# EAGLE design smartwatch (EAGLE 6.3)
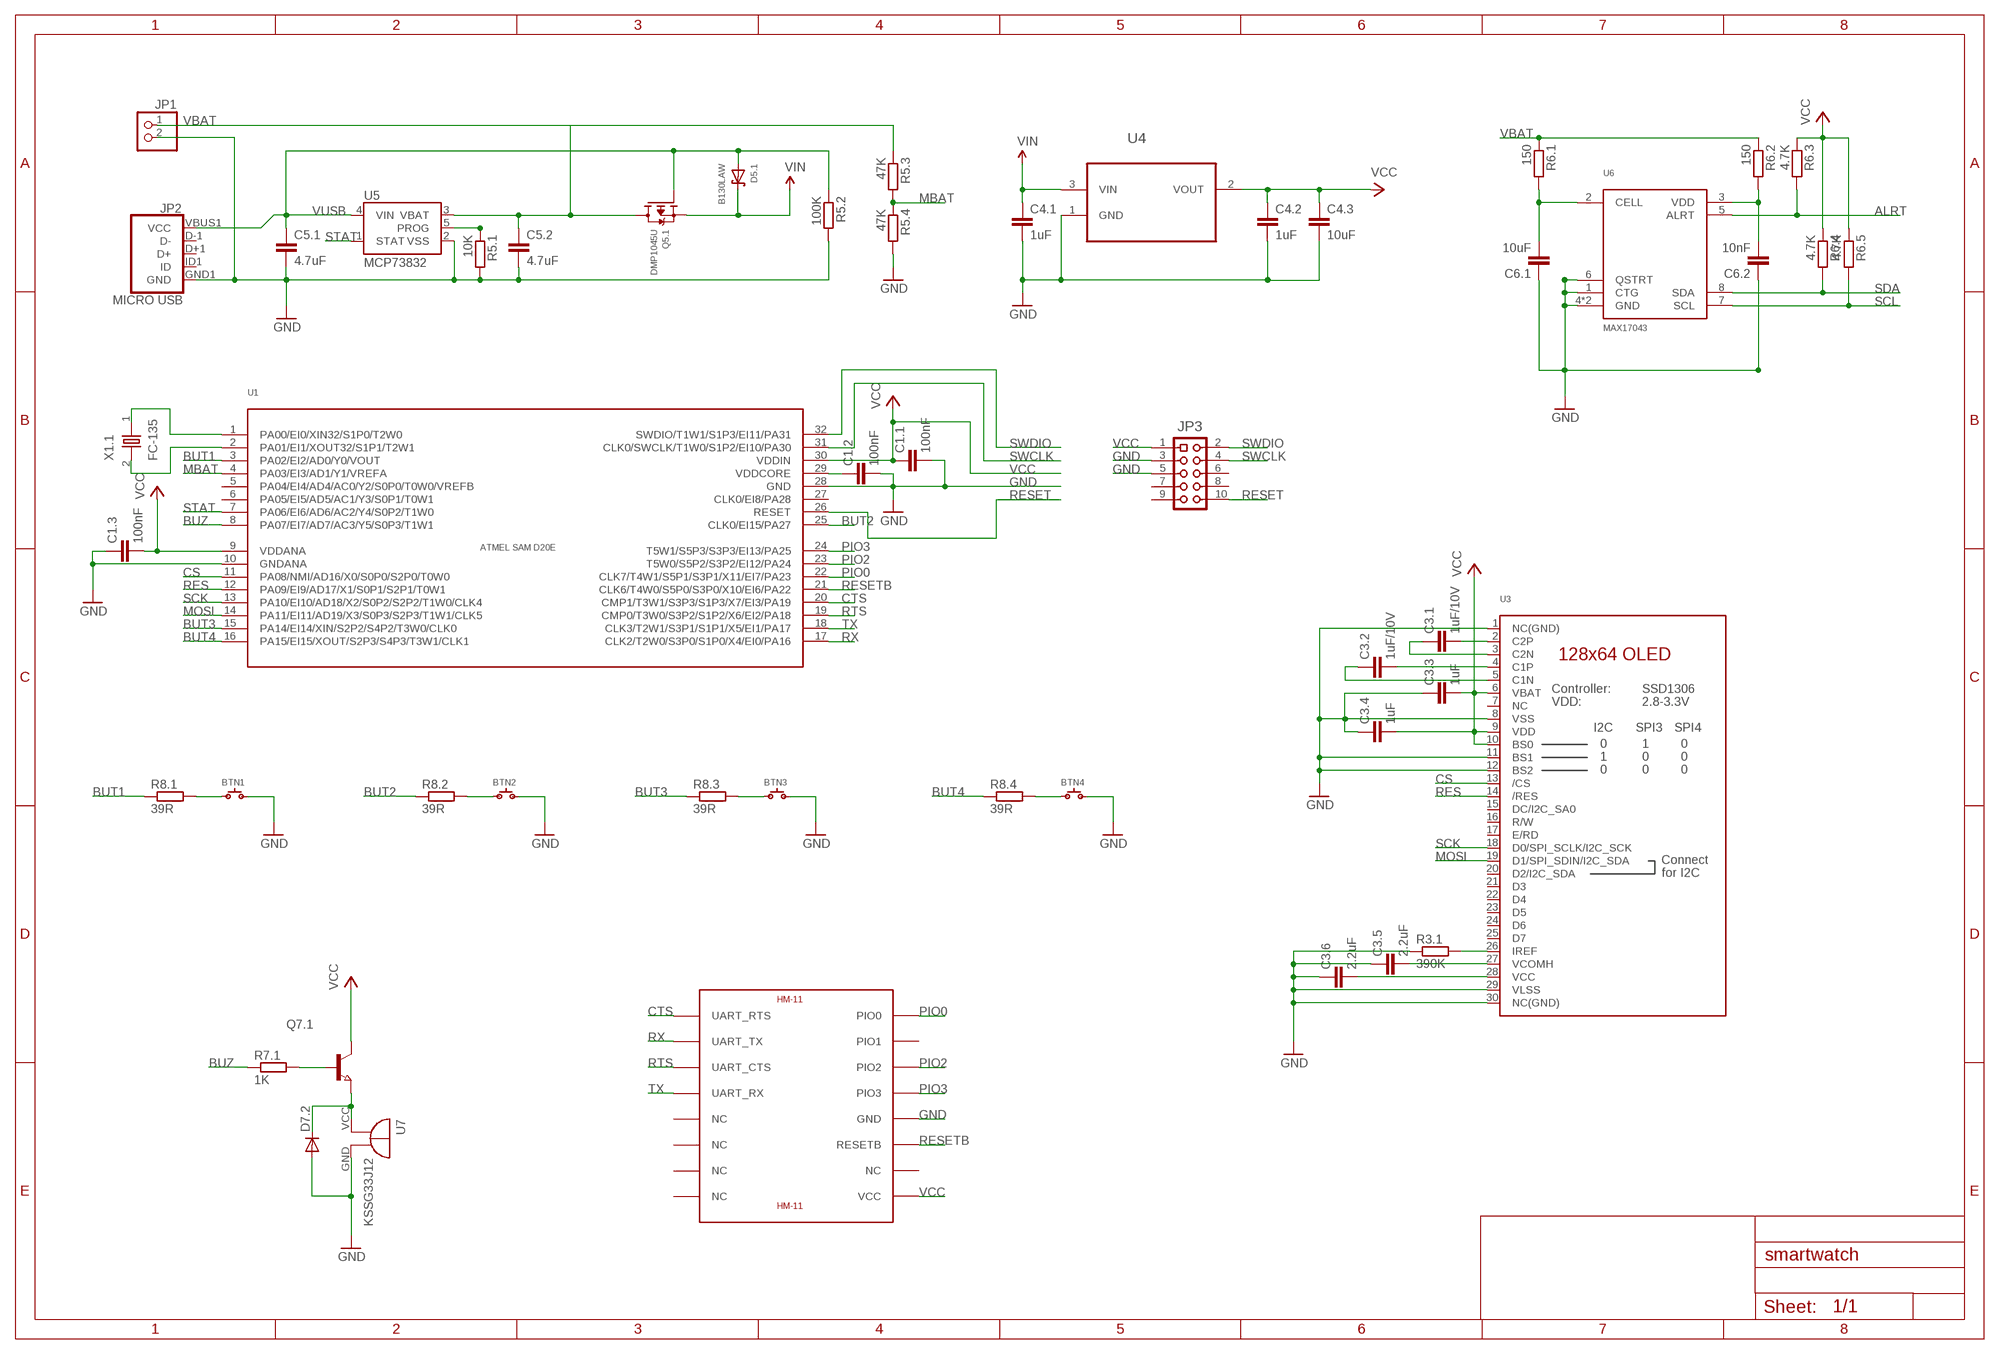
[diagram p0: schematic, sheet 1]

## Parts
BTN1  SPST.B3U-3000P(M)  [B3U-3000P(M)]
BTN2  SPST.B3U-3000P(M)  [B3U-3000P(M)]
BTN3  SPST.B3U-3000P(M)  [B3U-3000P(M)]
BTN4  SPST.B3U-3000P(M)  [B3U-3000P(M)]
C1.1  100nF  C-EUC0805  [C0805]
C1.2  100nF  C-EUC0805  [C0805]
C1.3  100nF  C-EUC0805  [C0805]
C3.1  1uF/10V  C-EUC0805  [C0805]
C3.2  1uF/10V  C-EUC0805  [C0805]
C3.3  1uF  C-EUC0805  [C0805]
C3.4  1uF  C-EUC0805  [C0805]
C3.5  2.2uF  C-EUC0805  [C0805]
C3.6  2.2uF  C-EUC0805  [C0805]
C4.1  1uF  C-EUC0805  [C0805]
C4.2  1uF  C-EUC0805  [C0805]
C4.3  10uF  C-EUC0805  [C0805]
C5.1  4.7uF  C-EUC0805  [C0805]
C5.2  4.7uF  C-EUC0805  [C0805]
C6.1  10uF  C-EUC0805  [C0805]
C6.2  10nF  C-EUC0805  [C0805]
D5.1  B130LAW  DIODE-SCHOTTKYSOD-123  [SOD-123]
D7.2  CGRM4001-G  [SOD-123_MINI-SMA]
JP1  PINHD-1X2  [1X02]
JP2  MICRO USB  USB_MICROB_PLUGCONN-11752  [USB-B-MICRO-SMD_V03]
JP3  PF2X5SMD1.27MM  [PF2X5SMD50MIL]
Q5.1  DMP1045U  MOSFET-P  [SOT23-R]
Q7.1  NPN-TRANSISTOR_SOT23  [SOT23]
R3.1  390K  R-EU_R2012  [R2012]
R5.1  10K  R-EU_R2012  [R2012]
R5.2  100K  R-EU_R2012  [R2012]
R5.3  47K  R-EU_R2012  [R2012]
R5.4  47K  R-EU_R2012  [R2012]
R6.1  150  R-EU_R2012  [R2012]
R6.2  150  R-EU_R2012  [R2012]
R6.3  4.7K  R-EU_R2012  [R2012]
R6.4  4.7K  R-EU_R2012  [R2012]
R6.5  4.7K  R-EU_R2012  [R2012]
R7.1  1K  R-EU_R2012  [R2012]
R8.1  39R  R-EU_R2012  [R2012]
R8.2  39R  R-EU_R2012  [R2012]
R8.3  39R  R-EU_R2012  [R2012]
R8.4  39R  R-EU_R2012  [R2012]
U1  SAMD20E  [TQFP32-08]
U2  HM-11  [HM-11]
U3  DISP_OLED_UG-2864HSWEG010.96"  [UG-2864HSWEG01_0.96IN_WRAPAROUND]
U4  MCP1700T-3302E/TT  [SOT95P237X112-3N]
U5  MCP73832  MCP73831  [SOT23-5]
U6  MAX17043  [8-TDFN-EP]
U7  KSSG33J12  [KSSG33J12]
X1.1  FC-135  FC-135FC-135  [FC-135]

## Nets
ALRT: R6.3.2 U6.5(ALRT)
BUT1: R8.1.1 U1.3(PA02/EI2/AD0/Y0/VOUT)
BUT2: R8.2.1 U1.25(CLK0/EI15/PA27)
BUT3: R8.3.1 U1.15(PA14/EI14/XIN/S2P2/S4P2/T3W0/CLK0)
BUT4: R8.4.1 U1.16(PA15/EI15/XOUT/S2P3/S4P3/T3W1/CLK1)
BUZ: R7.1.1 U1.8(PA07/EI7/AD7/AC3/Y5/S0P3/T1W1)
CS: U1.11(PA08/NMI/AD16/X0/S0P0/S2P0/T0W0) U3.13(/CS)
CTS: U1.20(CMP1/T3W1/S3P3/S1P3/X7/EI3/PA19) U2.UART_RTS
GND: BTN1.2 BTN2.2 BTN3.2 BTN4.2 C1.1.2 C1.2.2 C1.3.1 C3.3.1 C3.4.1 C3.5.1 C3.6.1 C4.1.2 C4.2.2 C4.3.2 C5.1.2 C5.2.2 C6.1.1 C6.2.1 D7.2.A JP1.2 JP2.GND1(GND) JP3.3 JP3.5 R3.1.1 R5.1.2 R5.2.2 R5.4.2 U1.10(GNDANA) U1.28(GND) U2.GND U3.1(NC(GND)) U3.8(VSS) U3.11(BS1) U3.12(BS2) U3.29(VLSS) U3.30(NC(GND)) U4.1(GND) U5.2(VSS) U6.1(CTG) U6.4(GND) U6.6(QSTRT) U6.9(GND) U7.GND(-)
MBAT: R5.3.2 R5.4.1 U1.4(PA03/EI3/AD1/Y1/VREFA)
MOSI: U1.14(PA11/EI11/AD19/X3/S0P3/S2P3/T1W1/CLK5) U3.19(D1/SPI_SDIN/I2C_SDA)
N$1: C3.1.2 U3.2(C2P)
N$2: C3.1.1 U3.3(C2N)
N$3: C3.2.2 U3.4(C1P)
N$4: C3.2.1 U3.5(C1N)
N$5: R3.1.2 U3.26(IREF)
N$7: C3.5.2 U3.27(VCOMH)
N$8: C3.6.2 U3.28(VCC)
N$9: BTN1.1 R8.1.2
N$12: U1.1(PA00/EI0/XIN32/S1P0/T2W0) X1.1.1
N$13: U1.2(PA01/EI1/XOUT32/S1P1/T2W1) X1.1.2
N$14: D7.2.C Q7.1.2(E) U7.VCC(+)
N$15: Q7.1.1(B) R7.1.2
N$16: BTN2.1 R8.2.2
N$17: C6.2.2 R6.2.2 U6.3(VDD)
N$18: BTN3.1 R8.3.2
N$19: BTN4.1 R8.4.2
N$20: C6.1.2 R6.1.2 U6.2(CELL)
PIO0: U1.22(CLK7/T4W1/S5P1/S3P1/X11/EI7/PA23) U2.PIO0
PIO2: U1.23(T5W0/S5P2/S3P2/EI12/PA24) U2.PIO2
PIO3: U1.24(T5W1/S5P3/S3P3/EI13/PA25) U2.PIO3
PROG: R5.1.1 U5.5(PROG)
RES: U1.12(PA09/EI9/AD17/X1/S0P1/S2P1/T0W1) U3.14(/RES)
RESET: JP3.10 U1.26(RESET)
RESETB: U1.21(CLK6/T4W0/S5P0/S3P0/X10/EI6/PA22) U2.RESETB
RTS: U1.19(CMP0/T3W0/S3P2/S1P2/X6/EI2/PA18) U2.UART_CTS
RX: U1.17(CLK2/T2W0/S3P0/S1P0/X4/EI0/PA16) U2.UART_TX
SCK: U1.13(PA10/EI10/AD18/X2/S0P2/S2P2/T1W0/CLK4) U3.18(D0/SPI_SCLK/I2C_SCK)
SCL: R6.5.2 U6.7(SCL)
SDA: R6.4.2 U6.8(SDA)
STAT: U1.7(PA06/EI6/AD6/AC2/Y4/S0P2/T1W0) U5.1(STAT)
SWCLK: JP3.4 U1.31(CLK0/SWCLK/T1W0/S1P2/EI10/PA30)
SWDIO: JP3.2 U1.32(SWDIO/T1W1/S1P3/EI11/PA31)
TX: U1.18(CLK3/T2W1/S3P1/S1P1/X5/EI1/PA17) U2.UART_RX
VBAT: C5.2.1 JP1.1 Q5.1.3(D) R5.3.1 R6.1.1 R6.2.1 U5.3(VBAT)
VCC: C1.1.1 C1.3.2 C3.3.2 C3.4.2 C4.2.1 C4.3.1 JP3.1 Q7.1.3(C) R6.3.1 R6.4.1 R6.5.1 U1.9(VDDANA) U1.30(VDDIN) U2.VCC U3.6(VBAT) U3.9(VDD) U3.10(BS0) U4.2(VOUT)
VDDCORE: C1.2.1 U1.29(VDDCORE)
VIN: C4.1.1 D5.1.C Q5.1.2(S) U4.3(VIN)
VUSB: C5.1.1 D5.1.A JP2.VBUS1(VCC) Q5.1.1(G) R5.2.1 U5.4(VIN)
Unconnected: JP2.D+1(D+) JP2.D-1(D-) JP2.ID1(ID) JP3.6 JP3.7 JP3.8 JP3.9 U1.5(PA04/EI4/AD4/AC0/Y2/S0P0/T0W0/VREFB) U1.6(PA05/EI5/AD5/AC1/Y3/S0P1/T0W1) U1.27(CLK0/EI8/PA28) U2.NC@5(NC) U2.NC@6(NC) U2.NC@7(NC) U2.NC@8(NC) U2.NC@10(NC) U2.PIO1 U3.7(NC) U3.15(DC/I2C_SA0) U3.16(R/W) U3.17(E/RD) U3.20(D2/I2C_SDA) U3.21(D3) U3.22(D4) U3.23(D5) U3.24(D6) U3.25(D7)

## Library data of the parts
BTN1-BTN4 = omron:SPST
C1.1-C1.3 C3.1-C3.6 C4.1-C4.3 C5.1 C5.2 C6.1 C6.2 = rcl:C-EU: CAPACITOR, European symbol
D5.1 = lbrzak:DIODE-SCHOTTKY
D7.2 = diode:CGRM400*-G: Molded plasitc,JEDEC SOD-123/Mini SMA Source: Comchip CGRM4001-G.pdf
JP1 = pinhead:PINHD-1X2: PIN HEADER
JP2 = SparkFun-Connectors:USB_MICROB_PLUG: USB Micro-B Plug Comes in a variety of packages. Check out Hirose's ZX-x0 line: http://www.hirose.co.jp/cataloge_hp/e24200011.pdf; PROD_ID: CONN-11752
JP3 = A_CONN:PF2X5
Q5.1 = lbrmicrobuilder:MOSFET-P: P-Channel Mosfet LEGEND VDS: Voltage Drain-Source ID: Drain Current RDS(ON): Drain-Source On-State Resistance VGS(TH): Gate-Source Threshold Voltage CISS: Drain-Source Input Capacitance SOT-23 Name VDS ID RDS(ON) VGS(TH) CISS Order Number IRLML5103 30V 760mA 600 mOhm -- 75pF @ 25V Digikey: IRLML5103PBFCT-ND IRLML6401 12V 4.3A 50 mOhm 950mV @ 250µA 830pF @ 10V Digikey: IRLML6401PBFTR-ND NTR0202PL 20V 400mA 800 mOhm 2.3V @ 250uA 70pF @ 5V Digikey: NTR0202PLT1GOSTR-ND NTR4101PT1G 20V 1.8A 85 mOhm 1.2V @ 250uA 675pF @ 10V Digikey: NTR4101PT1GOSCT-ND DMP2004K 20V 600mA 900 mOhm 1V @ 250uA 175pF @ 16V Digikey: DMP2004KDICT-ND PMV65XP 20V 3.9A 76 mOhm 950mV @ 1mA 725pF @ 20V Digikey: 568-2358-2-ND TO-252 Name VDS ID RDS(ON) VGS(TH) CISS Order Number AOD417 30V 25A 34 mOhm 3V @ 250µA 920pF @ 15V Digikey: 785-1106-2-ND
Q7.1 = semicon-smd-ipc:NPN-TRANSISTOR_: NPN TRANSISTOR
R3.1 R5.1-R5.4 R6.1-R6.5 R7.1 R8.1-R8.4 = resistor:R-EU_: RESISTOR, European symbol
U1 = samd20:SAMD20E
U2 = hm-11:HM-11: JNHuaMao HM-11 Bluetooth 4.0 Transceiver based on TI CC2540/CC2541
U3 = microbuilder:DISP_OLED_UG-2864HSWEG01: UG-2864HSWEG01 OLED display Both 1.3" and 0.96" models share the same FPC tab footprint, only the screen dimensions vary.
U4 = mcp1700T-330:MCP1700T-3302E/TT: Low Quiescent Current LDO; MPN: MCP1700T-3302E/TT; OC_FARNELL: 1296592; OC_NEWARK: 88H9817; PACKAGE: SOT23-3; SUPPLIER: Microchip
U5 = SparkFun:MCP73831: Microchip's MCP73831 Miniature single cell, fully integrated Li-Ion, Li-polymer charge management controller http://ww1.microchip.com/downloads/en/DeviceDoc/21984a.pdf
U6 = max17043:MAX17043
U7 = kssg33j12:KSSG33J12
X1.1 = m-pad-2.1:FC-135: Epson's FC-135 FC-145 Thin SMD High-Frequency Crystal unit High density mounting type SMD of 0.8mm Typ. thickness Excellent environmental capability Small packaging area and light weight Most suitable for small communication devices. Please send any comments to: messi@users.sourceforge.net

## Board
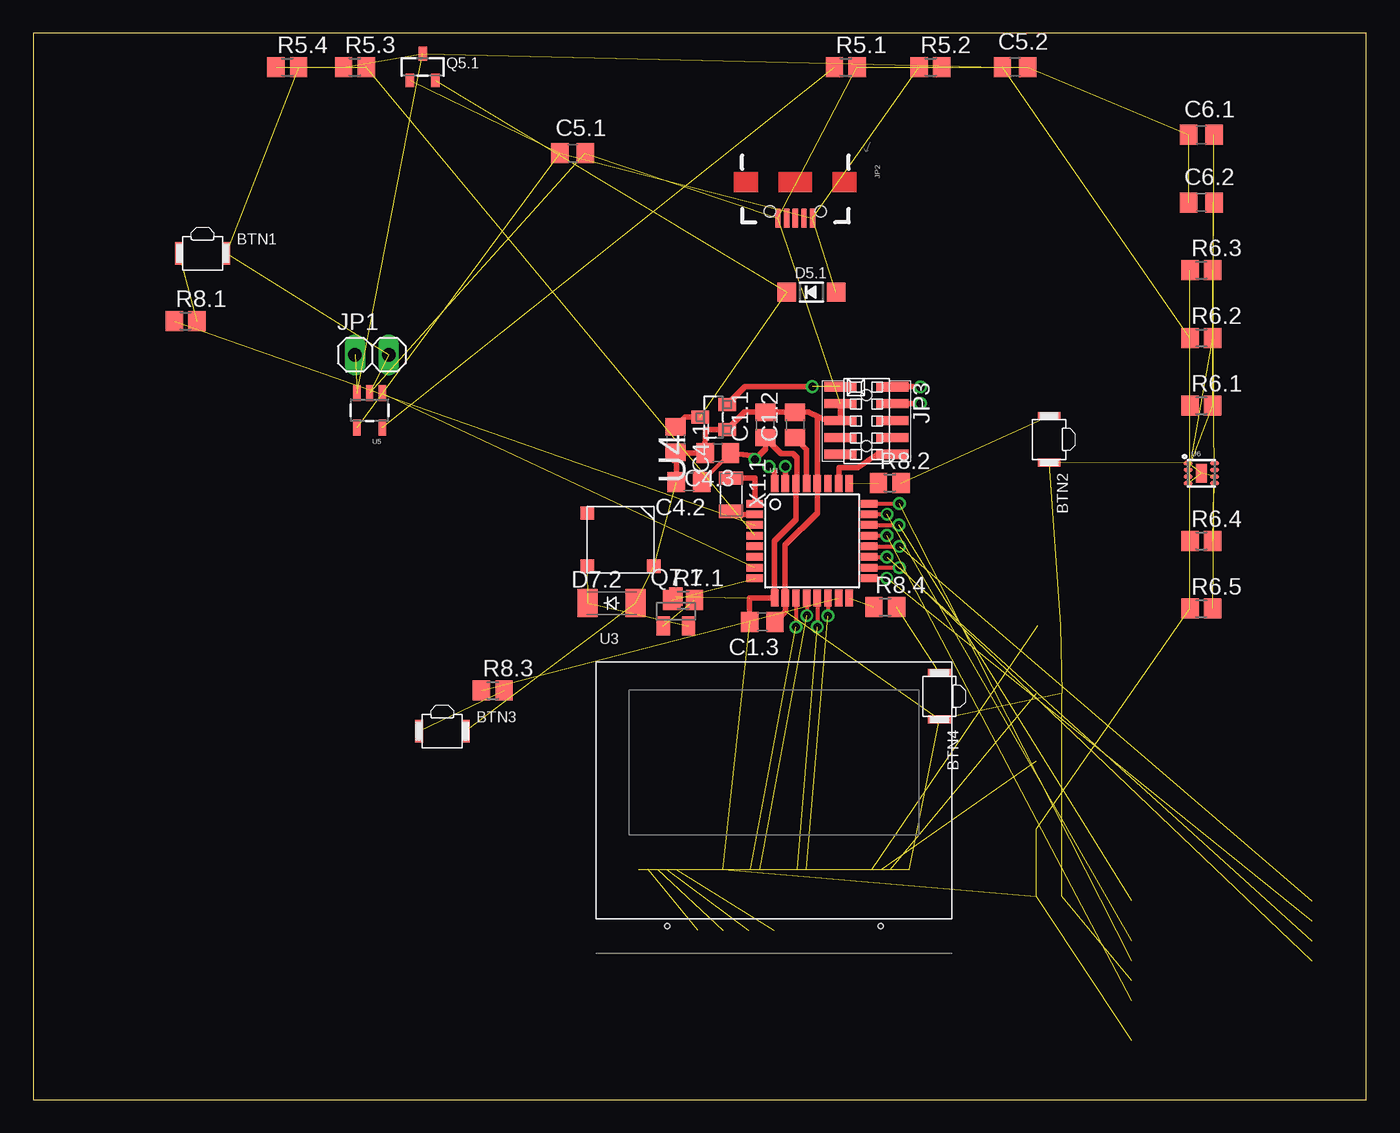
[diagram p1: board, top side]
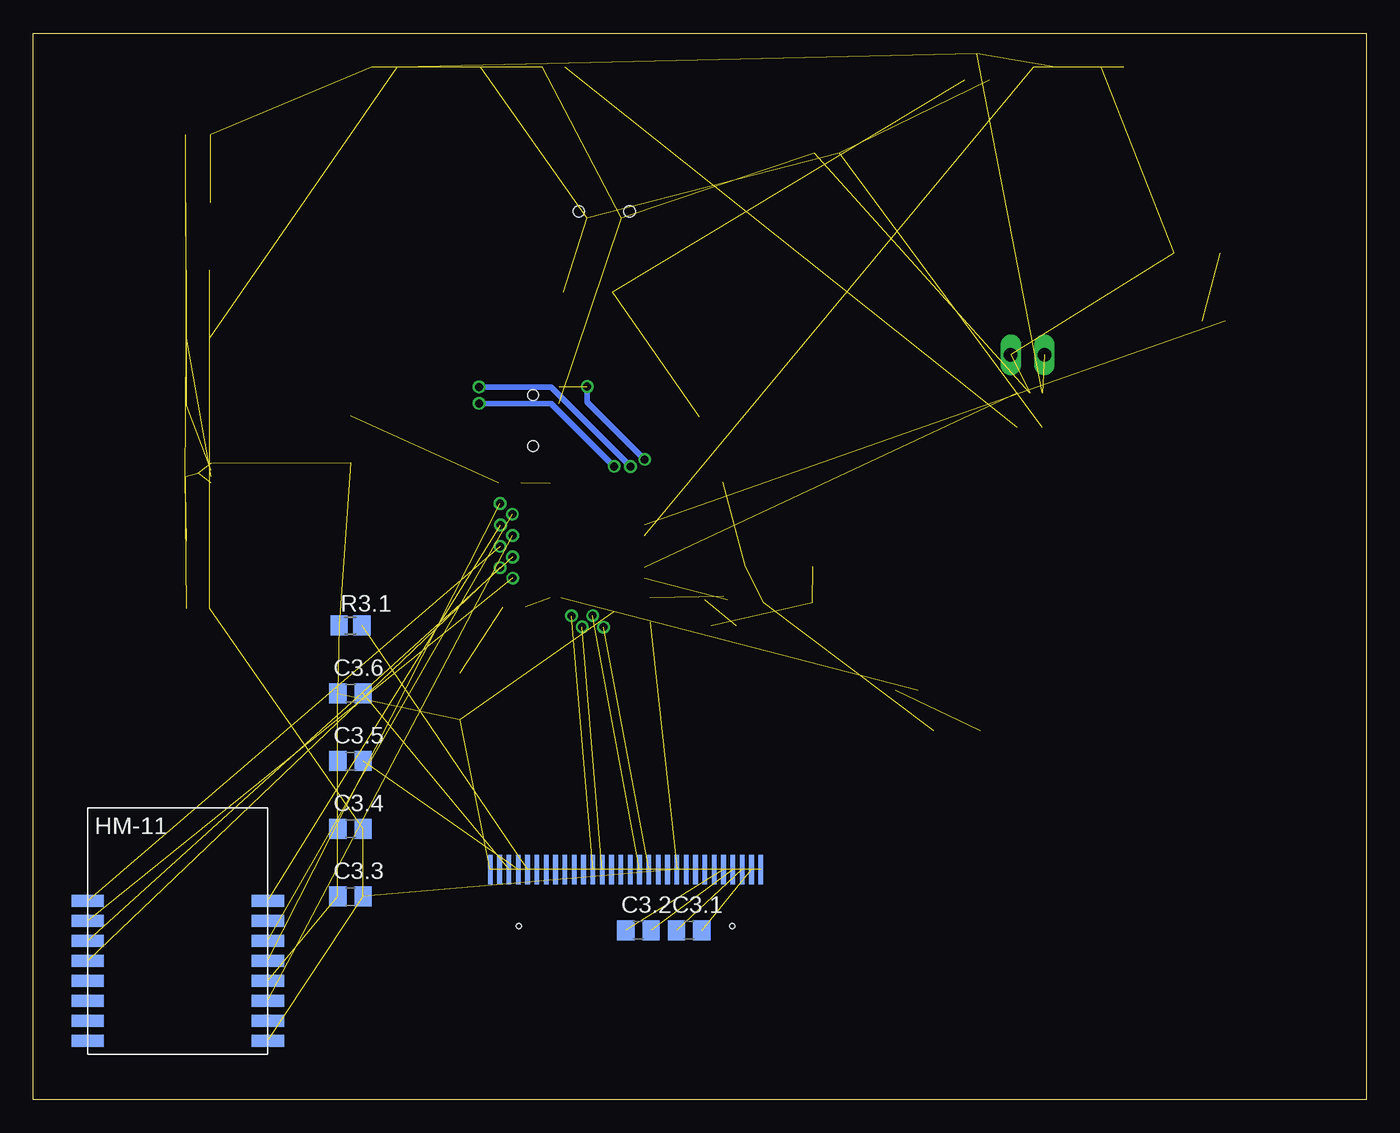
[diagram p2: board, bottom side, seen from below]

Size 100 x 80 mm. Coordinates in mm from the lower left corner, seen from the top.
Outline: 0,0 100,0 100,80 0,80 0,0
Copper layers (1*16): Top 0.0356mm / dielectric 1.5011mm / Bottom 0.0356mm
Design rules "LaenPCBOrder": minimum track width 6mil, minimum drill 13mil, track to track 6mil, track to pad 6mil, pad to pad 6mil, via to via 6mil, smd to smd 6mil, copper to edge 15mil, drill to drill 6mil, minimum pad ring 7mil, minimum via ring 7mil, stop-mask expansion 3mil, vias tented up to drill 0mil, thermal gap 10mil

### Footprints (pad centres in the part's own frame; a part is rotated, then mirrored left to right if it is on the bottom)
B3U-3000P(M) = smd 0.6 x 1.7: 1 -1.75,0; 2 1.75,0
C0805 = smd 1.3 x 1.5: 1 -0.95,0; 2 0.95,0
SOD-123 = smd 1.4 x 1.4: A 1.85,0; C -1.85,0
SOD-123_MINI-SMA = smd 1.5 x 2.1: A 1.8,0; C -1.8,0
1X02 = drill 1.016 long: 1 -1.27,0; 2 1.27,0
USB-B-MICRO-SMD_V03 = smd 1.4 x 0.4: D+1 2.7,0; D-1 2.7,0.65; GND1 2.7,-1.3; ID1 2.7,-0.65; VBUS1 2.7,1.3 | hole 0.85: 2.2,1.9; 2.2,-1.9
PF2X5SMD50MIL = smd 0.7 x 2.4: 1 -2.54,-1.95; 2 -2.54,1.95; 3 -1.27,-1.95; 4 -1.27,1.95; 5 0,-1.95; 6 0,1.95; 7 1.27,-1.95; 8 1.27,1.95; 9 2.54,-1.95; 10 2.54,1.95 | hole 0.8: -1.905,0; 1.905,0
SOT23-R = smd 0.635 x 1.016: 1 -0.95,-1; 2 0.95,-1; 3 0,1
SOT23 = smd 1 x 1.4: 1 -0.95,-1.1; 2 0.95,-1.1; 3 0,1.1
R2012 = smd 1.3 x 1.5: 1 -0.85,0; 2 0.85,0
TQFP32-08 = smd 1.27 x 0.559: 1 -4.293,2.8; 2 -4.293,2; 3 -4.293,1.2; 4 -4.293,0.4; 5 -4.293,-0.4; 6 -4.293,-1.2; 7 -4.293,-2; 8 -4.293,-2.8; 17 4.293,-2.8; 18 4.293,-2; 19 4.293,-1.2; 20 4.293,-0.4; 21 4.293,0.4; 22 4.293,1.2; 23 4.293,2; 24 4.293,2.8 | smd 0.559 x 1.27: 9 -2.8,-4.293; 10 -2,-4.293; 11 -1.2,-4.293; 12 -0.4,-4.293; 13 0.4,-4.293; 14 1.2,-4.293; 15 2,-4.293; 16 2.8,-4.293; 25 2.8,4.293; 26 2,4.293; 27 1.2,4.293; 28 0.4,4.293; 29 -0.4,4.293; 30 -1.2,4.293; 31 -2,4.293; 32 -2.8,4.293
HM-11 = smd 2.4 x 0.9: GND 6.5,0; NC@5 -7,0; NC@6 -7,-1.5; NC@7 -7,-3; NC@8 -7,-4.5; NC@10 6.5,-3; PIO0 6.5,6; PIO1 6.5,4.5; PIO2 6.5,3; PIO3 6.5,1.5; RESETB 6.5,-1.5; UART_CTS -7,3; UART_RTS -7,6; UART_RX -7,1.5; UART_TX -7,4.5; VCC 6.5,-4.5
UG-2864HSWEG01_0.96IN_WRAPAROUND = smd 0.35 x 2.2 bottom: 1 -10.15,-1.2; 2 -9.45,-1.2; 3 -8.75,-1.2; 4 -8.05,-1.2; 5 -7.35,-1.2; 6 -6.65,-1.2; 7 -5.95,-1.2; 8 -5.25,-1.2; 9 -4.55,-1.2; 10 -3.85,-1.2; 11 -3.15,-1.2; 12 -2.45,-1.2; 13 -1.75,-1.2; 14 -1.05,-1.2; 15 -0.35,-1.2; 16 0.35,-1.2; 17 1.05,-1.2; 18 1.75,-1.2; 19 2.45,-1.2; 20 3.15,-1.2; 21 3.85,-1.2; 22 4.55,-1.2; 23 5.25,-1.2; 24 5.95,-1.2; 25 6.65,-1.2; 26 7.35,-1.2; 27 8.05,-1.2; 28 8.75,-1.2; 29 9.45,-1.2; 30 10.15,-1.2 | hole 0.4: -8,-5.45; 8,-5.45
SOT95P237X112-3N = smd 0.991 x 1.321: 1 -0.94,-1.016; 2 0.94,-1.016; 3 0,1.016
SOT23-5 = smd 0.55 x 1.2: 1 -0.95,-1.3; 2 0,-1.3; 3 0.95,-1.3; 4 0.95,1.3; 5 -0.95,1.3
8-TDFN-EP = smd 0.7 x 0.3: 1 -0.99,0.75; 2 -0.99,0.25; 3 -0.99,-0.25; 4 -0.99,-0.75; 5 0.99,-0.75; 6 0.99,-0.25; 7 0.99,0.25; 8 0.99,0.75 | smd 0.8 x 1.38: 9 0,0
KSSG33J12 = smd 1 x 1: GND 2,-2.5; NC -3,1.5; VCC -3,-2.5
FC-135 = smd 1 x 1.8: 1 -1.25,0; 2 1.25,0

### Placement (x,y rotation side)
BTN1  12.7,63.5 0 top
BTN2  76.2,49.53 270 top
BTN3  30.68,27.64 0 top
BTN4  67.99,30.25 270 top
C1.1  54.92,50.62 90 top
C1.2  57.15,50.62 90 top
C1.3  54.7,35.84 180 top
C3.1  50.8,12.7 0 bottom
C3.2  54.61,12.7 0 bottom
C3.3  76.2,15.24 0 bottom
C3.4  76.2,20.32 0 bottom
C3.5  76.2,25.4 0 bottom
C3.6  76.2,30.48 0 bottom
C4.1  48.19,49.52 270 top
C4.2  49.19,46.34 180 top
C4.3  51.36,48.51 180 top
C5.1  40.46,70.99 0 top
C5.2  73.66,77.47 0 top
C6.1  87.63,72.39 0 top
C6.2  87.63,67.31 0 top
D5.1  58.38,60.58 0 top
D7.2  43.4,37.24 0 top
JP1  25.4,55.88 0 top
JP2  57.17,68.83 270 top
JP3  62.51,50.94 270 top
Q5.1  29.21,77.47 0 top
Q7.1  48.2,36.63 0 top
R3.1  76.2,35.56 0 bottom
R5.1  60.96,77.47 0 top
R5.2  67.31,77.47 0 top
R5.3  24.13,77.47 0 top
R5.4  19.05,77.47 0 top
R6.1  87.63,52.07 0 top
R6.2  87.63,57.15 0 top
R6.3  87.63,62.23 0 top
R6.4  87.63,41.91 0 top
R6.5  87.63,36.83 0 top
R7.1  48.75,37.47 0 top
R8.1  11.43,58.42 0 top
R8.2  64.26,46.26 0 top
R8.3  34.47,30.69 0 top
R8.4  63.91,36.95 0 top
U1  58.42,41.91 0 top
U2  88.9,8.89 0 bottom
U3  55.57,18.46 0 top
U4  51.05,51.2 90 top
U5  25.23,51.72 180 top
U6  87.63,46.99 0 top
U7  44.55,42.5 0 top
X1.1  52.36,45.38 270 top

### Tracks (layer width: path | path; a pad name or v marks a point on that pad's centre or on a via)
ALRT  (1 unrouted)
BUT1  (1 unrouted)
BUT2  (1 unrouted)
BUT3  (1 unrouted)
BUT4  (1 unrouted)
BUZ  (1 unrouted)
CS  (via drill 0.6)  (1 unrouted)
  Top 0.305: U1.11 v57.22,35.45
  Top 0.406: U1.11
CTS  (via drill 0.6)  (1 unrouted)
  Top 0.305: U1.20 v64.97,41.51
GND  (32 unrouted)
  Top 0.406: JP3.3 JP3.5 59.61,50.94 59.61,50.88 59.03,51.16 | 59.03,51.16 58.15,51.57 C1.2.2 C1.1.2 53.37,51.57 U4.1 | C1.3.1 56.42,36.62 U1.10 56.41,37.63 56.41,41.6 58.82,44.02 U1.28 58.82,51.16 59.03,51.16 | 52.06,49.96 U4.1 | C4.1.2 47.97,48.33 47.97,48.51 C4.3.2 50.43,50.26 U4.1 | C4.1.2 47.91,48.33 47.91,48.08 48.03,47.96 | C4.2.2 48.24,48.57 C4.1.2
MBAT  (2 unrouted)
MOSI  (via drill 0.6)  (1 unrouted)
  Top 0.305: U1.14 v59.62,36.29
  Top 0.406: U1.14
N$1  (1 unrouted)
N$2  (1 unrouted)
N$3  (1 unrouted)
N$4  (1 unrouted)
N$5  (1 unrouted)
N$7  (1 unrouted)
N$8  (1 unrouted)
N$9  (1 unrouted)
N$12
  Top 0.406: U1.1 54.13,46.63 X1.1.1
N$13
  Top 0.406: U1.2 52.36,43.91 X1.1.2
N$14  (2 unrouted)
N$15  (1 unrouted)
N$16  (1 unrouted)
N$17  (2 unrouted)
N$18  (1 unrouted)
N$19  (1 unrouted)
N$20  (2 unrouted)
PIO0  (via drill 0.6)  (1 unrouted)
  Top 0.305: U1.22 v64.95,43.11
PIO2  (via drill 0.6)  (1 unrouted)
  Top 0.305: U1.23 v64.06,43.91
PIO3  (via drill 0.6)  (1 unrouted)
  Top 0.305: U1.24 v64.98,44.72
PROG  (1 unrouted)
RES  (via drill 0.6)  (1 unrouted)
  Top 0.305: U1.12 v58.03,36.3
  Top 0.406: U1.12
RESET
  Top 0.406: U1.26 60.45,46.23 60.45,47.38 60.48,47.42 61.87,47.42 63.31,48.4 JP3.10
RESETB  (via drill 0.6)  (1 unrouted)
  Top 0.305: U1.21 v64.04,42.31
RTS  (via drill 0.6)  (1 unrouted)
  Top 0.305: U1.19 | U1.19 v64.04,40.71
RX  (via drill 0.6)  (1 unrouted)
  Top 0.305: U1.17 v64.03,39.11
SCK  (via drill 0.6)  (1 unrouted)
  Top 0.305: U1.13 v58.82,35.46
  Top 0.406: U1.13
SCL  (1 unrouted)
SDA  (1 unrouted)
STAT  (1 unrouted)
SWCLK  (via drill 0.6)
  Top 0.406: U1.31 56.4,46.23 56.42,46.25 v56.42,47.51 | v66.55,52.23 66.53,52.21 JP3.4
  Bottom 0.406: v56.42,47.51 61.14,52.23 v66.55,52.23
SWDIO  (via drill 0.6)
  Top 0.406: U1.32 55.62,47.08 v55.19,47.5 | v66.55,53.47 66.54,53.48 JP3.2
  Bottom 0.406: v55.19,47.5 61.16,53.47 v66.55,53.47
TX  (via drill 0.6)  (1 unrouted)
  Top 0.305: U1.18 | U1.18 v64.98,39.91
VBAT  (6 unrouted)
VCC  (via drill 0.6)  (11 unrouted)
  Top 0.305: 52.13,48.33 C4.2.1
  Top 0.406: C1.3.2 53.75,37.62 U1.9 55.61,41.92 57.22,43.52 U1.30 57.29,46.28 57.29,48.16 56.99,48.47 56.1,48.47 54.92,49.64 C1.1.1 54.92,48.83 v54.13,48.03 arc90 53.83,48.33 C4.3.1 52.31,48.33 52.13,48.33 | U4.2 53.41,53.49 v58.44,53.49
  Bottom 0.406: v58.44,53.49 58.44,52.34 v54.13,48.03
VDDCORE
  Top 0.406: U1.29 58.02,48.78 C1.2.1
VIN  (2 unrouted)
  Top 0.406: C4.1.1 48.88,51.2 U4.3
VUSB  (5 unrouted)